# Altium schematic sheet FPGA IO.SchDoc
size 420 x 297 mm; SheetNumber: 4; SheetTotal: 12
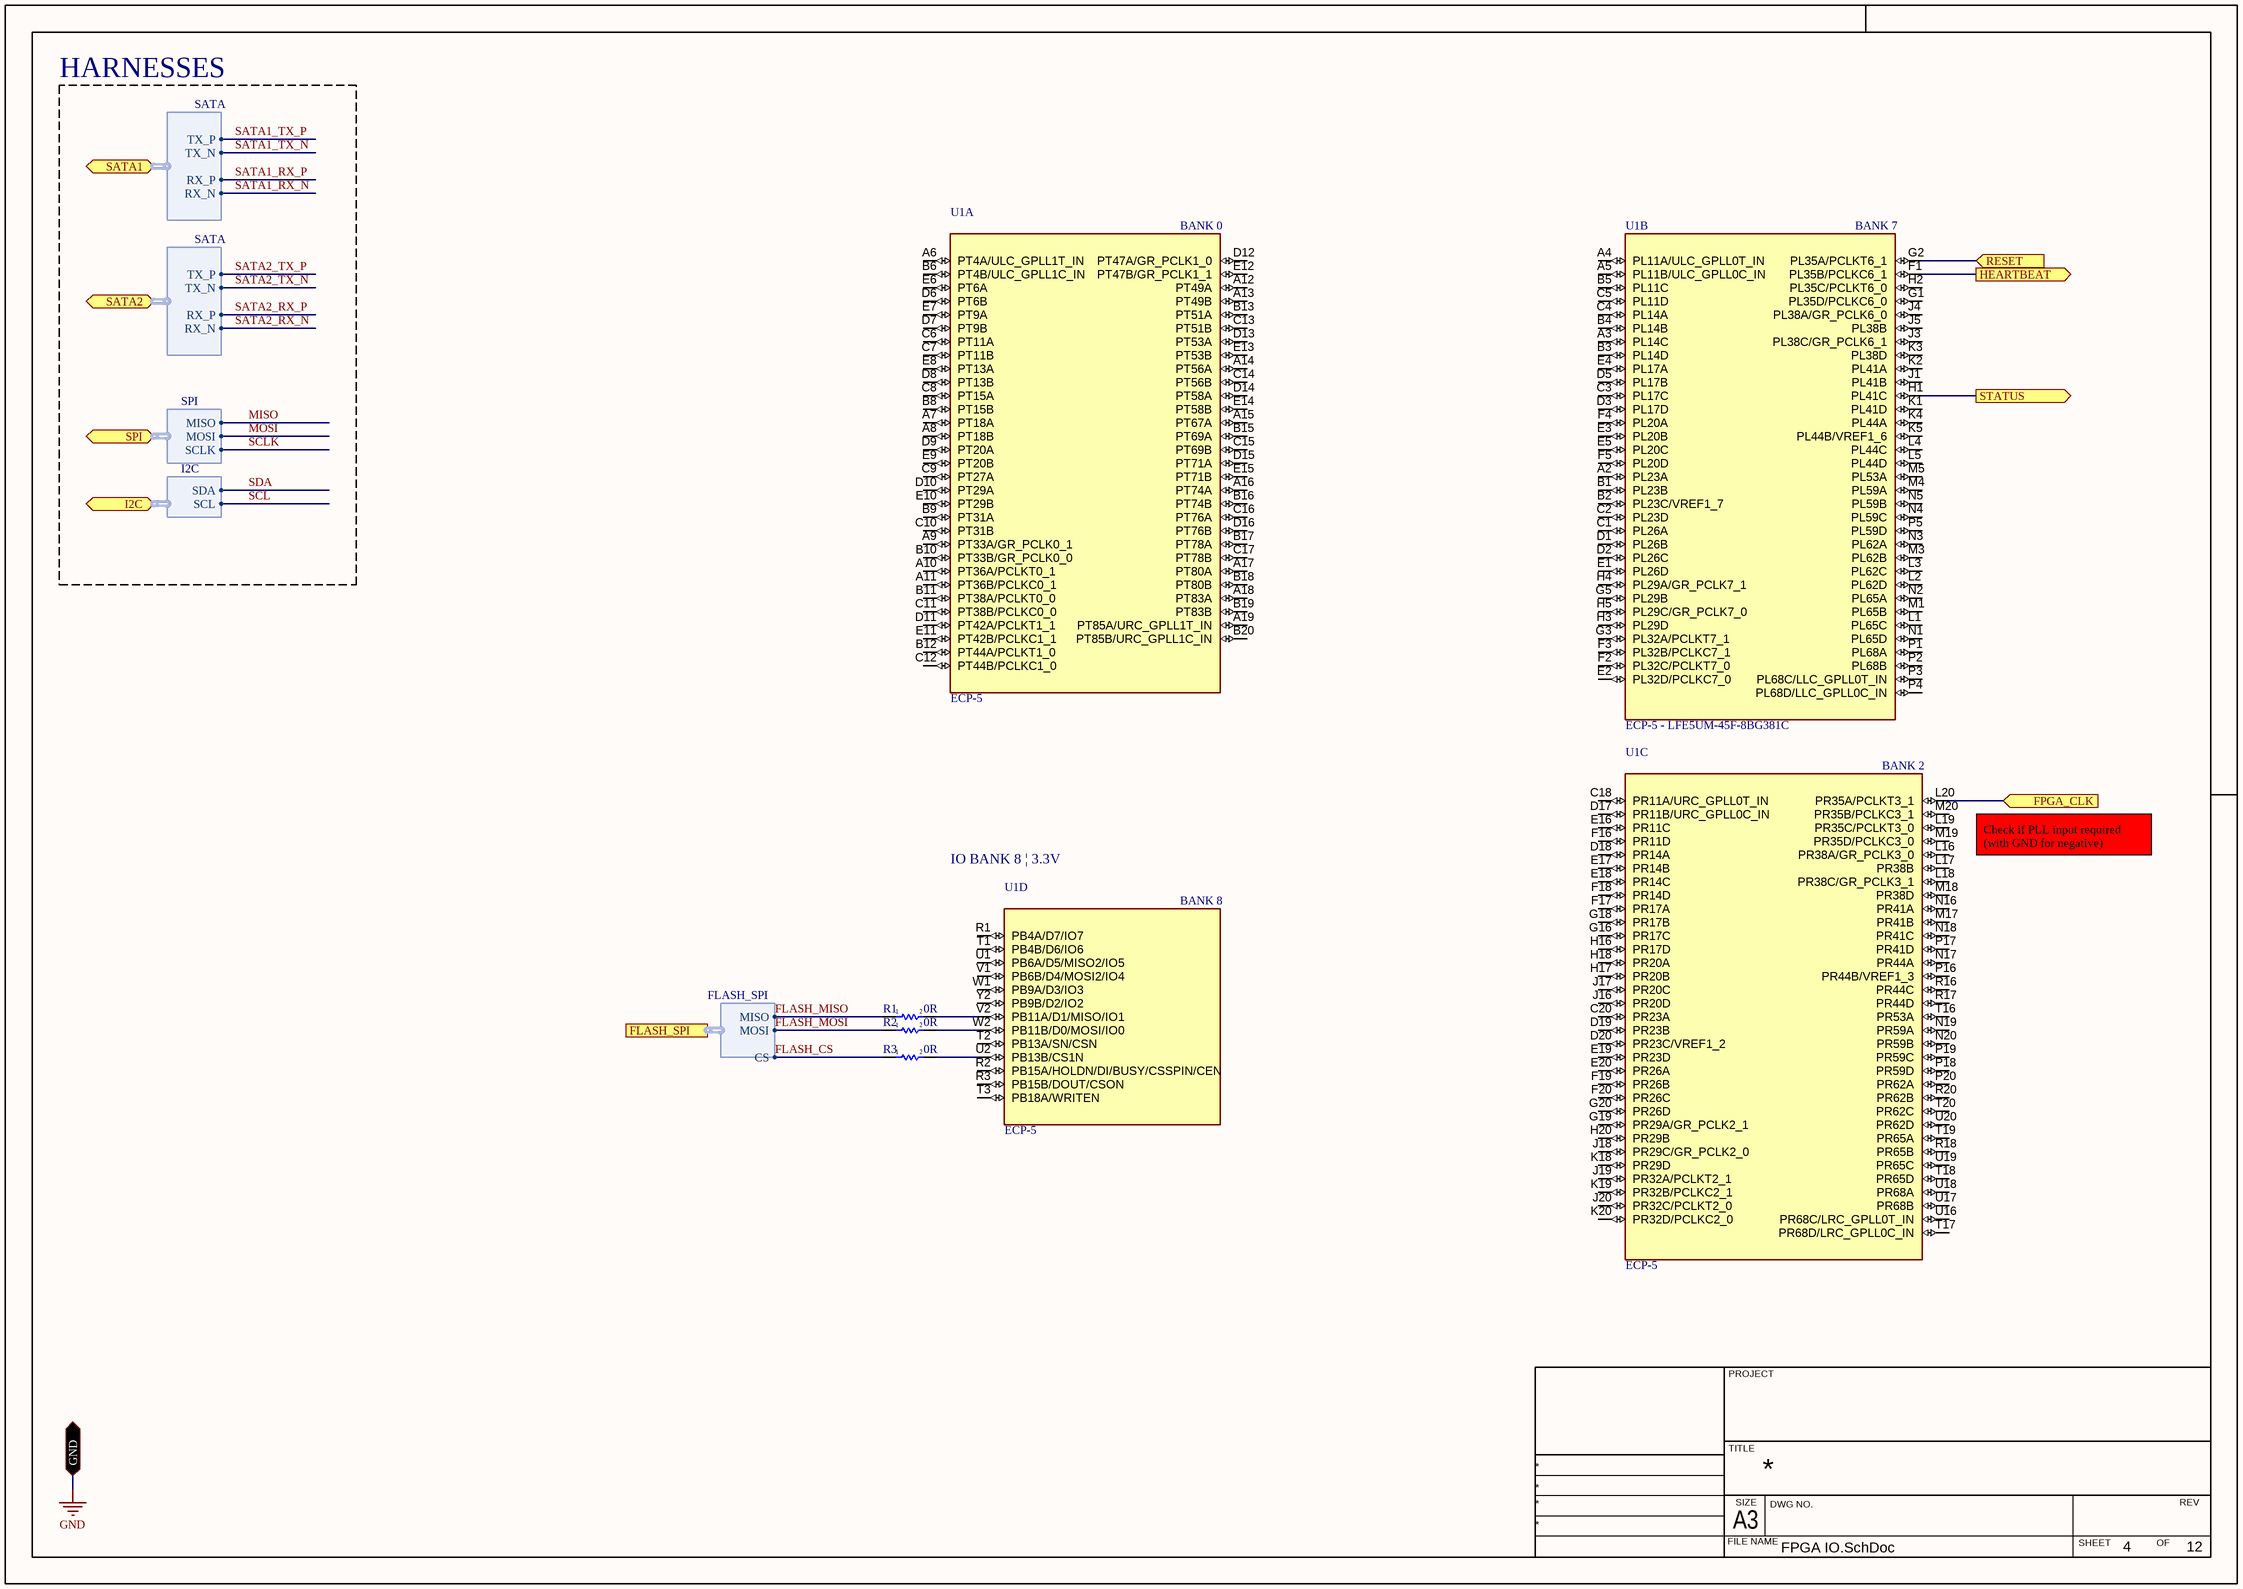
[diagram p0: FPGA IO.SchDoc]

## Parts
R1  0R  [RES_0603]
R2  0R  [RES_0603]
R3  0R  [RES_0603]
U1  ECP-5  [CABGA-381]  (parts A,B,C,D of 7)

## Ports
FLASH_SPI (harness FLASH_SPI), FPGA_CLK (in), GND (bidir), HEARTBEAT (out), I2C (bidir, harness I2C), RESET (in), SATA1 (bidir, harness SATA), SATA2 (bidir, harness SATA), SPI (bidir, harness SPI), STATUS (out)

## Harnesses
FLASH_SPI: MISO, MOSI, CS
SATA: TX_P, TX_N, RX_P, RX_N
I2C: SDA, SCL
SPI: MISO, MOSI, SCLK

## Nets
GND: port GND
FLASH_CS: R3.1 ; port FLASH_SPI.CS
FLASH_MISO: R1.1 ; port FLASH_SPI.MISO
FLASH_MOSI: R2.1 ; port FLASH_SPI.MOSI
FPGA_CLK: U1.L20(PR35A/PCLKT3_1) ; port FPGA_CLK
HEARTBEAT: U1.F1(PL35B/PCLKC6_1) ; port HEARTBEAT
MISO: port SPI.MISO
MOSI: port SPI.MOSI
RESET: U1.G2(PL35A/PCLKT6_1) ; port RESET
SATA1_RX_N: port SATA1.RX_N
SATA1_RX_P: port SATA1.RX_P
SATA1_TX_N: port SATA1.TX_N
SATA1_TX_P: port SATA1.TX_P
SATA2_RX_N: port SATA2.RX_N
SATA2_RX_P: port SATA2.RX_P
SATA2_TX_N: port SATA2.TX_N
SATA2_TX_P: port SATA2.TX_P
SCL: port I2C.SCL
SCLK: port SPI.SCLK
SDA: port I2C.SDA
STATUS: U1.H1(PL41C) ; port STATUS
NetR1_2: R1.2 U1.V2(PB11A/D1/MISO/IO1)
NetR2_2: R2.2 U1.W2(PB11B/D0/MOSI/IO0)
NetR3_2: R3.2 U1.U2(PB13B/CS1N)

Not connected (* = marked no-connect by the designer): U1 A2(PL23A) A3(PL14C) A4(PL11A/ULC_GPLL0T_IN) A5(PL11B/ULC_GPLL0C_IN) A6(PT4A/ULC_GPLL1T_IN) A7(PT18A) A8(PT18B) A9(PT33A/GR_PCLK0_1) A10(PT36A/PCLKT0_1) A11(PT36B/PCLKC0_1) A12(PT49A) A13(PT49B) A14(PT56A) A15(PT67A) A16(PT74A) A17(PT80A) A18(PT83A) A19(PT85A/URC_GPLL1T_IN) B1(PL23B) B2(PL23C/VREF1_7) B3(PL14D) B4(PL14B) B5(PL11C) B6(PT4B/ULC_GPLL1C_IN) B8(PT15B) B9(PT31A) B10(PT33B/GR_PCLK0_0) B11(PT38A/PCLKT0_0) B12(PT44A/PCLKT1_0) B13(PT51A) B15(PT69A) B16(PT74B) B17(PT78A) B18(PT80B) B19(PT83B) B20(PT85B/URC_GPLL1C_IN) C1(PL26A) C2(PL23D) C3(PL17C) C4(PL14A) C5(PL11D) C6(PT11A) C7(PT11B) C8(PT15A) C9(PT27A) C10(PT31B) C11(PT38B/PCLKC0_0) C12(PT44B/PCLKC1_0) C13(PT51B) C14(PT56B) C15(PT69B) C16(PT76A) C17(PT78B) C18(PR11A/URC_GPLL0T_IN) C20(PR23A) D1(PL26B) D2(PL26C) D3(PL17D) D5(PL17B) D6(PT6B) D7(PT9B) D8(PT13B) D9(PT20A) D10(PT29A) D11(PT42A/PCLKT1_1) D12(PT47A/GR_PCLK1_0) D13(PT53A) D14(PT58A) D15(PT71A) D16(PT76B) D17(PR11B/URC_GPLL0C_IN) D18(PR14A) D19(PR23B) D20(PR23C/VREF1_2) E1(PL26D) E2(PL32D/PCLKC7_0) E3(PL20B) E4(PL17A) E5(PL20C) E6(PT6A) E7(PT9A) E8(PT13A) E9(PT20B) E10(PT29B) E11(PT42B/PCLKC1_1) E12(PT47B/GR_PCLK1_1) E13(PT53B) E14(PT58B) E15(PT71B) E16(PR11C) E17(PR14B) E18(PR14C) E19(PR23D) E20(PR26A) F2(PL32C/PCLKT7_0) F3(PL32B/PCLKC7_1) F4(PL20A) F5(PL20D) F16(PR11D) F17(PR17A) F18(PR14D) F19(PR26B) F20(PR26C) G1(PL35D/PCLKC6_0) G3(PL32A/PCLKT7_1) G5(PL29B) G16(PR17C) G18(PR17B) G19(PR29A/GR_PCLK2_1) G20(PR26D) H2(PL35C/PCLKT6_0) H3(PL29D) H4(PL29A/GR_PCLK7_1) H5(PL29C/GR_PCLK7_0) H16(PR17D) H17(PR20B) H18(PR20A) H20(PR29B) J1(PL41B) J3(PL38C/GR_PCLK6_1) J4(PL38A/GR_PCLK6_0) J5(PL38B) J16(PR20D) J17(PR20C) J18(PR29C/GR_PCLK2_0) J19(PR32A/PCLKT2_1) J20(PR32C/PCLKT2_0) K1(PL41D) K2(PL41A) K3(PL38D) K4(PL44A) K5(PL44B/VREF1_6) K18(PR29D) K19(PR32B/PCLKC2_1) K20(PR32D/PCLKC2_0) L1(PL65C) L2(PL62D) L3(PL62C) L4(PL44C) L5(PL44D) L16(PR38A/GR_PCLK3_0) L17(PR38B) L18(PR38C/GR_PCLK3_1) L19(PR35C/PCLKT3_0) M1(PL65B) M3(PL62B) M4(PL59A) M5(PL53A) M17(PR41B) M18(PR38D) M19(PR35D/PCLKC3_0) M20(PR35B/PCLKC3_1) N1(PL65D) N2(PL65A) N3(PL62A) N4(PL59C) N5(PL59B) N16(PR41A) N17(PR44A) N18(PR41C) N19(PR59A) N20(PR59B) P1(PL68A) P2(PL68B) P3(PL68C/LLC_GPLL0T_IN) P4(PL68D/LLC_GPLL0C_IN) P5(PL59D) P16(PR44B/VREF1_3) P17(PR41D) P18(PR59D) P19(PR59C) P20(PR62A) R1(PB4A/D7/IO7) R2(PB15A/HOLDN/DI/BUSY/CSSPIN/CEN) R3(PB15B/DOUT/CSON) R16(PR44C) R17(PR44D) R18(PR65B) R20(PR62B) T1(PB4B/D6/IO6) T2(PB13A/SN/CSN) T3(PB18A/WRITEN) T16(PR53A) T17(PR68D/LRC_GPLL0C_IN) T18(PR65D) T19(PR65A) T20(PR62C) U1(PB6A/D5/MISO2/IO5) U16(PR68C/LRC_GPLL0T_IN) U17(PR68B) U18(PR68A) U19(PR65C) U20(PR62D) V1(PB6B/D4/MOSI2/IO4) W1(PB9A/D3/IO3) Y2(PB9B/D2/IO2)

## Notes on the sheet
- HARNESSES
- IO BANK 8 | 3.3V
- Check if PLL input required
  (with GND for negative)
- PROJECT
- TITLE
- FILE NAME
- A3
- SIZE
- DWG NO.
- SHEET
- OF
- REV
- (in symbol IC_LFE5UM-45F-8BG381C, part A) BANK 0
- (in symbol IC_LFE5UM-45F-8BG381C, part B) BANK 7
- (in symbol IC_LFE5UM-45F-8BG381C, part C) BANK 2
- (in symbol IC_LFE5UM-45F-8BG381C, part D) BANK 8

## Library data of the parts
R1-R3 = RESISTOR: Power: 1/8W; Tolerance: 10%; Automotive: *; Operating Temperature: *; Package / Case: 0603; # Digikey: *; ComponentLink1Description: Digikey; ComponentLink1URL: *; # Manufacturer: *
U1 = IC_LFE5UM-45F-8BG381C: IC FPGA 203 I/O 381CABGA; Mfr: Lattice Semiconductors; Supply Voltage: 1.045V - 1.115V; LABs/CLBs: 11000; Logic Elements: 44000; IOs: 203; RAM Bits: 1990656; Operating Temperature: 0C - 85C; Package / Case: 381-CABGA